# Altium schematic sheet POWER.SchDoc
size A4; SheetNumber: 3; SheetTotal: 5
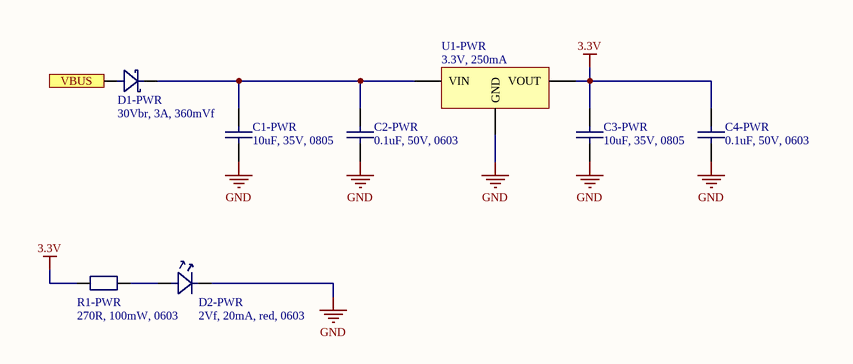
[diagram p0: POWER.SchDoc]

## Parts
C1-PWR  10uF, 35V, 0805  [0805 [2012]]
C2-PWR  0.1uF, 50V, 0603  [0603 [1608]]
C3-PWR  10uF, 35V, 0805  [0805 [2012]]
C4-PWR  0.1uF, 50V, 0603  [0603 [1608]]
D1-PWR  30Vbr, 3A, 360mVf  [SOD-128]
D2-PWR  2Vf, 20mA, red, 0603  [LED 0603 [1608]]
R1-PWR  270R, 100mW, 0603  [0603 [1608]]
U1-PWR  3.3V, 250mA  [SOT-23-3]

## Ports
VBUS (in, see OVERVIEW[2A], USB-PORT[1A])

## Nets
3.3V: C3-PWR.1 C4-PWR.2 R1-PWR.2 U1-PWR.2(VOUT)
GND: C1-PWR.2 C2-PWR.1 C3-PWR.2 C4-PWR.1 D2-PWR.1 U1-PWR.1(GND)
VBUS: D1-PWR.2 ; port VBUS
NetC1-PWR_1: C1-PWR.1 C2-PWR.2 D1-PWR.1 U1-PWR.3(VIN)
NetD2-PWR_2: D2-PWR.2 R1-PWR.1

## Library data of the parts
C1-PWR C3-PWR = Capacitor: Manufacturer: MURATA; Manufacturer ID: GRM21BR6YA106KE43L; Supplier: Farnell; Supplier ID: 2611943; URL: https://ee.farnell.com/murata/grm21br6ya106ke43l/cap-10-f-35v-10-x5r-0805/dp/2611943
C2-PWR C4-PWR = Capacitor: Manufacturer: MULTICOMP PRO; Manufacturer ID: MC0603B104J500CT; Supplier: Farnell; Supplier ID: 2320803; URL: https://ee.farnell.com/multicomp/mc0603b104j500ct/cap-0-1-f-50v-5-x7r-0603/dp/2320803?st=100%20nf
D1-PWR = Schottky Rectifier (Diode): Manufacturer: NEXPERIA; Manufacturer ID: PMEG3030EP,115; Supplier: Farnell; Supplier ID: 1829195; URL: https://ee.farnell.com/nexperia/pmeg3030ep-115/diode-schottky-rec-30v-3a-sod128/dp/1829195
D2-PWR = LED: Manufacturer: VISHAY; Manufacturer ID: VLMS1300-GS08; Supplier: Farnell; Supplier ID: 2251484; URL: https://ee.farnell.com/vishay/vlms1300-gs08/led-0603-red/dp/2251484?st=led
R1-PWR = Resistor: Manufacturer: YAGEO; Manufacturer ID: RC0603FR-07270RL; Supplier: Farnell; Supplier ID: 9238417; URL: https://ee.farnell.com/yageo/rc0603fr-07270rl/res-270r-1-0-1w-0603-thick-film/dp/9238417
U1-PWR = LDO Regulator: Fixed LDO Voltage Regulator, 2.3V to 6V, 178mV Dropout, 3.3Vout, 250mAout, SOT-23-3; Manufacturer: Microchip; Manufacturer ID: MCP1700T-3302E/TT; Supplier: Farnell; Supplier ID: 1296592; URL: https://ee.farnell.com/microchip/mcp1700t-3302e-tt/ic-v-reg-ldo-250ma-smd-sot-23/dp/1296592?st=3.3